# Altium schematic sheet NvideaJetsonNano.SchDoc: Nvidea Jetson Nano
size A3; Author: Cooper Richmond; DrawnBy: Cooper Richmond; Organization: WACT^2 (QUT) - DRC; Address1: Cooper Richmond
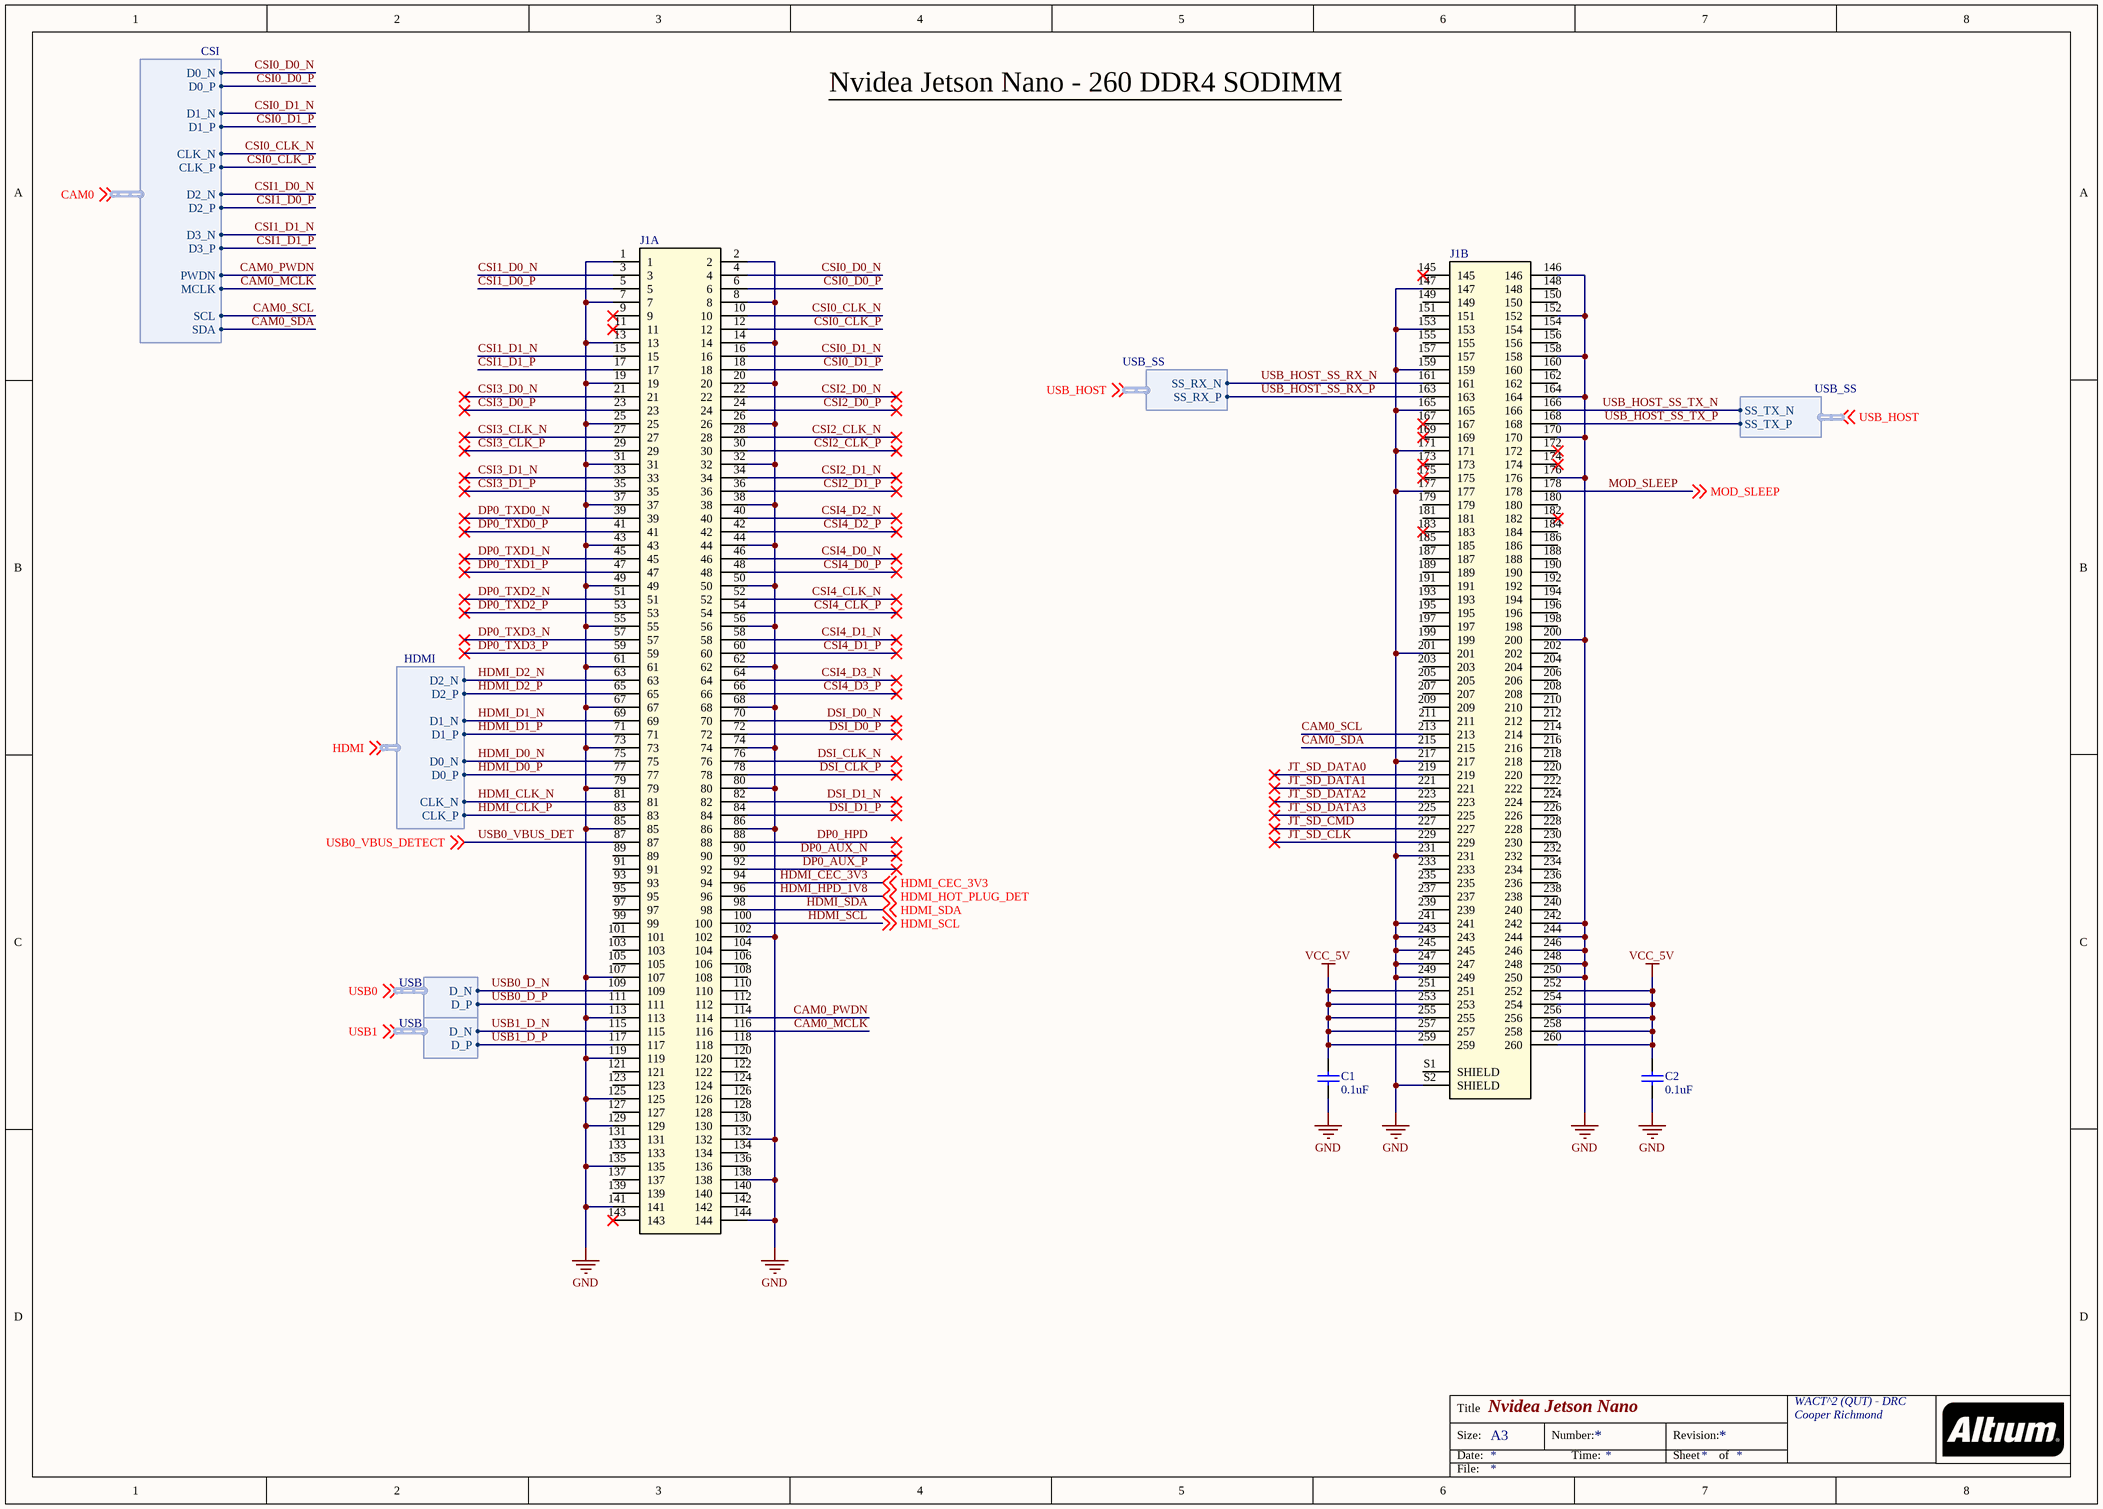
[diagram p0: NvideaJetsonNano.SchDoc]

## Parts
C1  value 0.1uF  [C0402]  (hidden comment: CAP)
C2  value 0.1uF  [C0402]  (hidden comment: CAP)
J1  2309411-2  [TE_2309411]  (value not drawn)  (parts A,B of 2)

## Harnesses
USB: D_N, D_P
HDMI: D2_N, D2_P, D1_N, D1_P, D0_N, D0_P, CLK_N, CLK_P
CSI: D0_N, D0_P, D1_N, D1_P, CLK_N, CLK_P, D2_N, D2_P, D3_N, D3_P, PWDN, MCLK, SCL, SDA
USB_SS: SS_RX_P, SS_RX_N
USB_SS: SS_TX_N, SS_TX_P

## Nets
GND: C1.2 C2.2 J1.1 J1.2 J1.7 J1.8 J1.13 J1.14 J1.19 J1.20 J1.25 J1.26 J1.31 J1.32 J1.37 J1.38 J1.43 J1.44 J1.49 J1.50 J1.55 J1.56 J1.61 J1.62 J1.67 J1.68 J1.73 J1.74 J1.79 J1.80 J1.85 J1.86 J1.102 J1.107 J1.113 J1.119 J1.125 J1.129 J1.132 J1.135 J1.138 J1.141 J1.144 J1.146 J1.147 J1.152 J1.153 J1.158 J1.159 J1.164 J1.165 J1.170 J1.171 J1.176 J1.177 J1.200 J1.201 J1.217 J1.231 J1.241 J1.242 J1.243 J1.244 J1.245 J1.246 J1.247 J1.248 J1.249 J1.250 J1.S2(SHIELD)
VCC_5V: C1.1 C2.1 J1.251 J1.252 J1.253 J1.254 J1.255 J1.256 J1.257 J1.258 J1.259 J1.260
CAM0_MCLK: J1.116 ; harness CSI.MCLK
CAM0_PWDN: J1.114 ; harness CSI.PWDN
CAM0_SCL: J1.213 ; harness CSI.SCL
CAM0_SDA: J1.215 ; harness CSI.SDA
CSI0_CLK_N: J1.10 ; harness CSI.CLK_N
CSI0_CLK_P: J1.12 ; harness CSI.CLK_P
CSI0_D0_N: J1.4 ; harness CSI.D0_N
CSI0_D0_P: J1.6 ; harness CSI.D0_P
CSI0_D1_N: J1.16 ; harness CSI.D1_N
CSI0_D1_P: J1.18 ; harness CSI.D1_P
CSI1_D0_N: J1.3 ; harness CSI.D2_N
CSI1_D0_P: J1.5 ; harness CSI.D2_P
CSI1_D1_N: J1.15 ; harness CSI.D3_N
CSI1_D1_P: J1.17 ; harness CSI.D3_P
CSI2_CLK_N: J1.28
CSI2_CLK_P: J1.30
CSI2_D0_N: J1.22
CSI2_D0_P: J1.24
CSI2_D1_N: J1.34
CSI2_D1_P: J1.36
CSI3_CLK_N: J1.27
CSI3_CLK_P: J1.29
CSI3_D0_N: J1.21
CSI3_D0_P: J1.23
CSI3_D1_N: J1.33
CSI3_D1_P: J1.35
CSI4_CLK_N: J1.52
CSI4_CLK_P: J1.54
CSI4_D0_N: J1.46
CSI4_D0_P: J1.48
CSI4_D1_N: J1.58
CSI4_D1_P: J1.60
CSI4_D2_N: J1.40
CSI4_D2_P: J1.42
CSI4_D3_N: J1.64
CSI4_D3_P: J1.66
DP0_AUX_N: J1.90
DP0_AUX_P: J1.92
DP0_HPD: J1.88
DP0_TXD0_N: J1.39
DP0_TXD0_P: J1.41
DP0_TXD1_N: J1.45
DP0_TXD1_P: J1.47
DP0_TXD2_N: J1.51
DP0_TXD2_P: J1.53
DP0_TXD3_N: J1.57
DP0_TXD3_P: J1.59
DSI_CLK_N: J1.76
DSI_CLK_P: J1.78
DSI_D0_N: J1.70
DSI_D0_P: J1.72
DSI_D1_N: J1.82
DSI_D1_P: J1.84
HDMI_CEC_3V3: J1.94 ; off-sheet HDMI_CEC_3V3
HDMI_CLK_N: J1.81 ; harness HDMI.CLK_N
HDMI_CLK_P: J1.83 ; harness HDMI.CLK_P
HDMI_D0_N: J1.75 ; harness HDMI.D0_N
HDMI_D0_P: J1.77 ; harness HDMI.D0_P
HDMI_D1_N: J1.69 ; harness HDMI.D1_N
HDMI_D1_P: J1.71 ; harness HDMI.D1_P
HDMI_D2_N: J1.63 ; harness HDMI.D2_N
HDMI_D2_P: J1.65 ; harness HDMI.D2_P
HDMI_HPD_1V8: J1.96 ; off-sheet HDMI_HOT_PLUG_DET  [also labelled HDMI_HOT_PLUG_DET]
HDMI_SCL: J1.100 ; off-sheet HDMI_SCL
HDMI_SDA: J1.98 ; off-sheet HDMI_SDA
JT_SD_CLK: J1.229
JT_SD_CMD: J1.227
JT_SD_DATA0: J1.219
JT_SD_DATA1: J1.221
JT_SD_DATA2: J1.223
JT_SD_DATA3: J1.225
MOD_SLEEP: J1.178 ; off-sheet MOD_SLEEP
USB0_D_N: J1.109 ; harness USB.D_N
USB0_D_P: J1.111 ; harness USB.D_P
USB0_VBUS_DET: J1.87 ; off-sheet USB0_VBUS_DETECT  [also labelled USB0_VBUS_DETECT]
USB1_D_N: J1.115 ; harness USB.D_N
USB1_D_P: J1.117 ; harness USB.D_P
USB_HOST_SS_RX_N: J1.161 ; harness USB_SS.SS_RX_N
USB_HOST_SS_RX_P: J1.163 ; harness USB_SS.SS_RX_P
USB_HOST_SS_TX_N: J1.166 ; harness USB_SS.SS_TX_N
USB_HOST_SS_TX_P: J1.168 ; harness USB_SS.SS_TX_P

Not connected (* = marked no-connect by the designer): J1 9* 11* 89 91 93 95 97 99 101 103 104 105 106 108 110 112 118 120 121 122 123 124 126 127 128 130 131 133 134 136 137 139 140 142 143* 145* 148 149 150 151 154 155 156 157 160 162 167* 169* 172* 173* 174* 175* 179 180 181 182* 183* 184 185 186 187 188 189 190 191 192 193 194 195 196 197 198 199 202 203 204 205 206 207 208 209 210 211 212 214 216 218 220 222 224 226 228 230 232 233 234 235 236 237 238 239 240 S1(SHIELD)

## Notes on the sheet
- Nvidea Jetson Nano - 260 DDR4 SODIMM
- Labels drawn without touching a wire or pin: CAM0, HDMI, USB0, USB1, USB_HOST
- Title
- Size:
- Date:
- A3
- Number:
- Time:
- Revision:
- Sheet
- of
- File:

## Library data of the parts
C1 C2 = CAP: =Description
J1 = 2309411-2: DDR4 SODIMM 260P 8.0H STD; Centerline_Pitch: .5 mm[.0197 in]; Number_of_Positions: 260; MF: TE Connectivity; Product_Type: Socket; MP: 2309411-2; SnapEDA_Link: https://www.snapeda.com/parts/2309411-2/TE%20Connectivity/view-part/?ref=snap; TE_purchase_URL: https://www.te.com/usa-en/product-2309411-2.html?te_bu=Cor&te_type=disp&te_campaign=seda_glo_cor-seda-global-disp-prtnr-fy19-seda-model-bom-cta_sma-317_1&elqCampaignId=32493; Package: None; EU_RoHS_Compliance: Compliant; Price: None; Value: *